# EAGLE design Skaarhoj VU board (EAGLE 6.2)
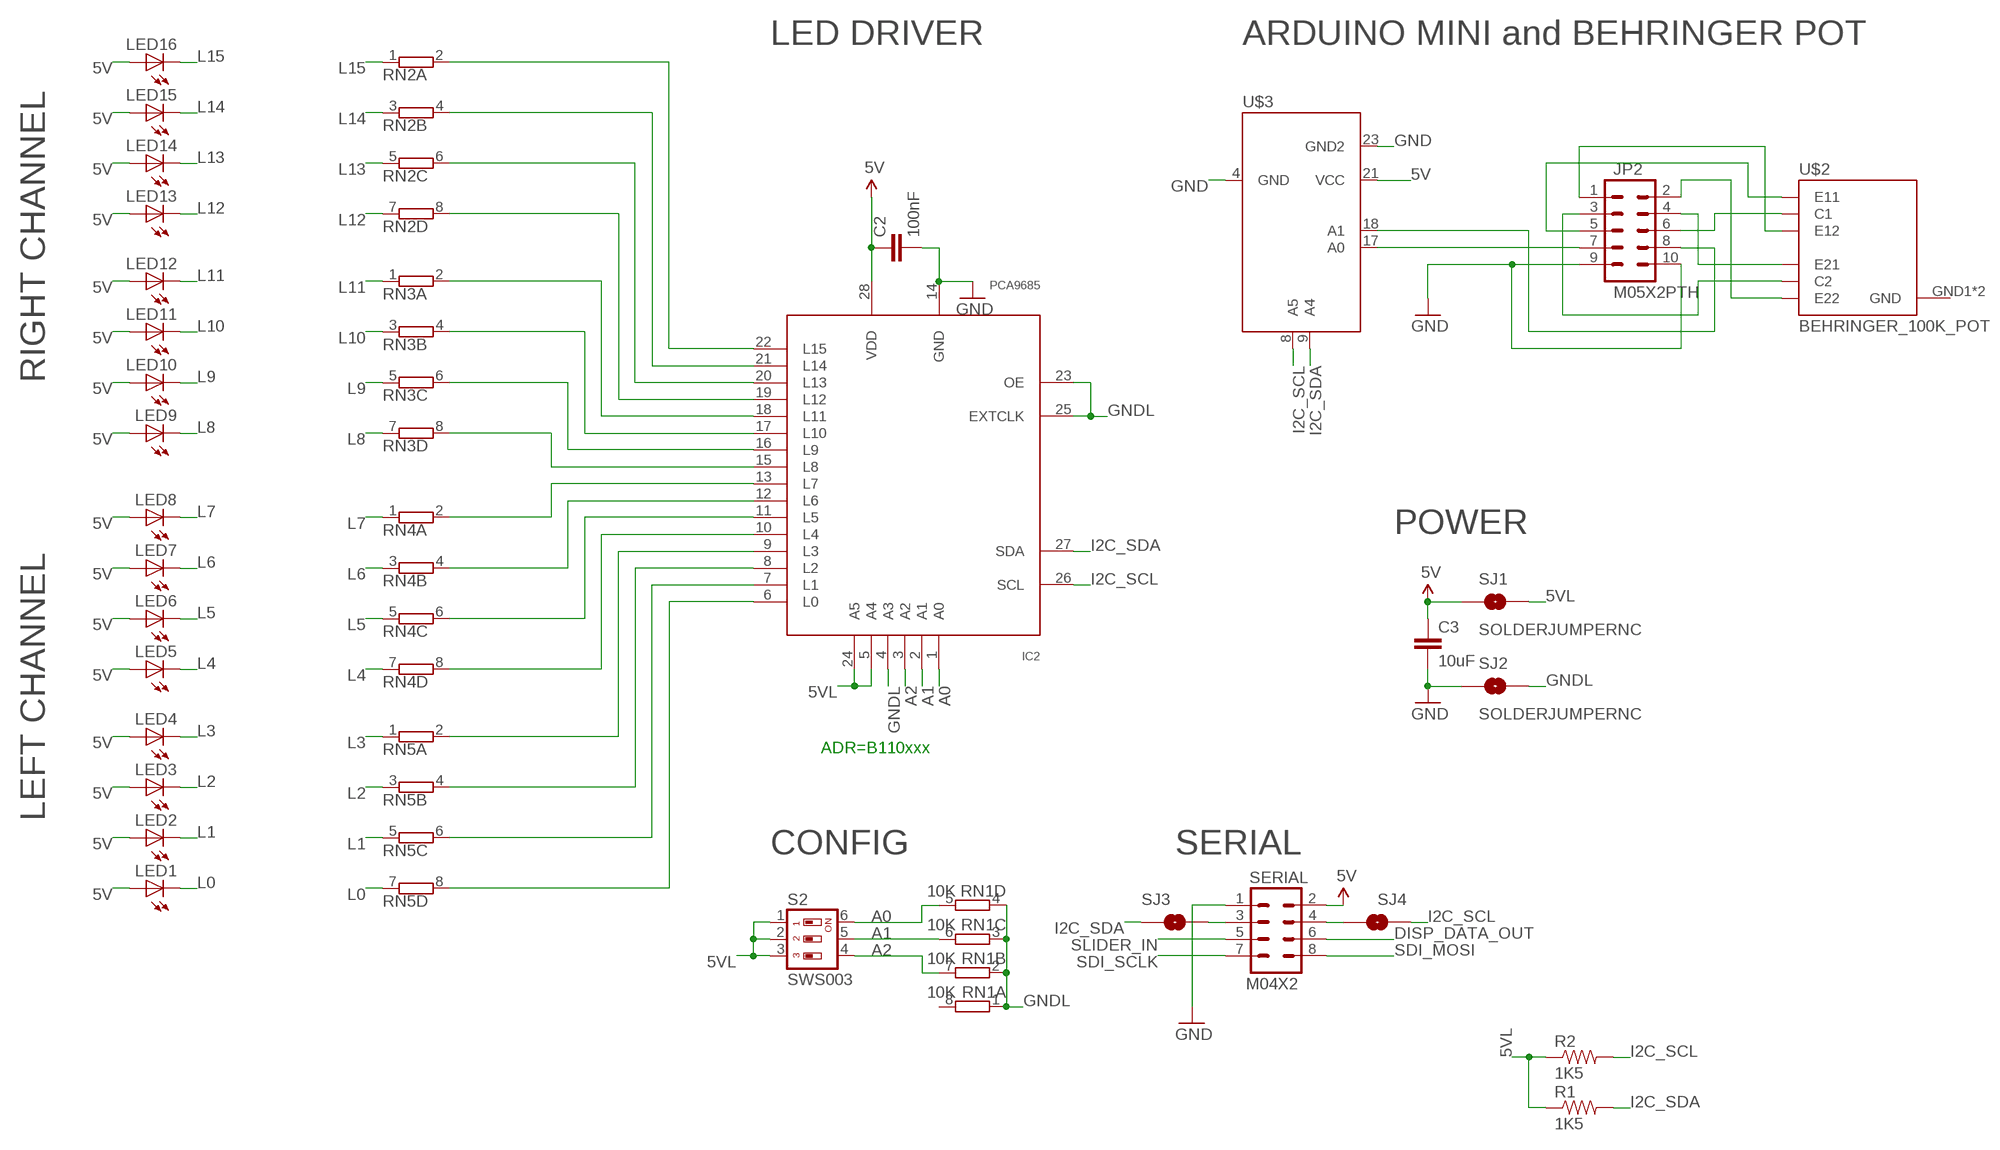
[diagram p0: schematic, sheet 1]

## Parts
C2  100nF  CAP0603-CAP  [0603-CAP]
C3  10uF  CAP0805  [0805]
IC2  PCA9685  [TSSOP28]
JP2  M05X2PTH  [AVR_ICSP]
LED1  LED3MM  [LED3MM]
LED2  LED3MM  [LED3MM]
LED3  LED3MM  [LED3MM]
LED4  LED3MM  [LED3MM]
LED5  LED3MM  [LED3MM]
LED6  LED3MM  [LED3MM]
LED7  LED3MM  [LED3MM]
LED8  LED3MM  [LED3MM]
LED9  LED3MM  [LED3MM]
LED10  LED3MM  [LED3MM]
LED11  LED3MM  [LED3MM]
LED12  LED3MM  [LED3MM]
LED13  LED3MM  [LED3MM]
LED14  LED3MM  [LED3MM]
LED15  LED3MM  [LED3MM]
LED16  LED3MM  [LED3MM]
R1  1K5  RESISTOR0603-RES  [0603-RES]
R2  1K5  RESISTOR0603-RES  [0603-RES]
RN1  10K  4R-NCAY16  [CAY16_HAND]
RN2  E4R  [SIL8]
RN3  E4R  [SIL8]
RN4  E4R  [SIL8]
RN5  E4R  [SIL8]
S2  SWS003  [SMS-003]
SERIAL  M04X2  [2X4]
SJ1  SOLDERJUMPERNC  [SJ_2S]
SJ2  SOLDERJUMPERNC  [SJ_2S]
SJ3  SOLDERJUMPERNC  [SJ_2S]
SJ4  SOLDERJUMPERNC  [SJ_2S]
U$2  BEHRINGER_100K_POT  [BEHRINGER_100K_POT]
U$3  ARDUINO_MINI_SE1  [ARDUINO_MINI_SE1]

## Nets
5V [Power]: C2.1 C3.1 IC2.28(VDD) LED1.A LED2.A LED3.A LED4.A LED5.A LED6.A LED7.A LED8.A LED9.A LED10.A LED11.A LED12.A LED13.A LED14.A LED15.A LED16.A SERIAL.2 SJ1.1 U$3.21(VCC)
5VL: IC2.5(A4) IC2.24(A5) R1.1 R2.1 S2.1 S2.2 S2.3 SJ1.2
A0: IC2.1(A0) RN1.5 S2.6
A1: IC2.2(A1) RN1.6 S2.5
A2: IC2.3(A2) RN1.7 S2.4
DISP_DATA_OUT: SERIAL.6
GND [Power]: C2.2 C3.2 IC2.14(GND) JP2.9 JP2.10 SERIAL.1 SJ2.1 U$3.4(GND) U$3.23(GND2)
GNDL: IC2.4(A3) IC2.23(OE) IC2.25(EXTCLK) RN1.1 RN1.2 RN1.3 RN1.4 SJ2.2
I2C_SCL: IC2.26(SCL) R2.2 SJ4.2 U$3.8(A5)
I2C_SDA: IC2.27(SDA) R1.2 SJ3.1 U$3.9(A4)
L0: LED1.K(C) RN5.7
L1: LED2.K(C) RN5.5
L2: LED3.K(C) RN5.3
L3: LED4.K(C) RN5.1
L4: LED5.K(C) RN4.7
L5: LED6.K(C) RN4.5
L6: LED7.K(C) RN4.3
L7: LED8.K(C) RN4.1
L8: LED9.K(C) RN3.7
L9: LED10.K(C) RN3.5
L10: LED11.K(C) RN3.3
L11: LED12.K(C) RN3.1
L12: LED13.K(C) RN2.7
L13: LED14.K(C) RN2.5
L14: LED15.K(C) RN2.3
L15: LED16.K(C) RN2.1
N$1: JP2.6 U$2.PAD1(C1)
N$2: JP2.4 U$2.PAD3(E21)
N$3: SERIAL.3 SJ3.2
N$4: IC2.13(L7) RN4.2
N$5: IC2.12(L6) RN4.4
N$6: SERIAL.4 SJ4.1
N$7: IC2.11(L5) RN4.6
N$8: JP2.3 U$2.PAD4(C2)
N$9: IC2.10(L4) RN4.8
N$10: IC2.9(L3) RN5.2
N$11: IC2.8(L2) RN5.4
N$12: IC2.7(L1) RN5.6
N$13: JP2.2 U$2.PAD5(E22)
N$14: JP2.5 U$2.PAD2(E11)
N$15: JP2.1 U$2.PAD6(E12)
N$16: JP2.8 U$3.18(A1)
N$17: JP2.7 U$3.17(A0)
N$19: IC2.6(L0) RN5.8
N$20: IC2.15(L8) RN3.8
N$21: IC2.16(L9) RN3.6
N$22: IC2.17(L10) RN3.4
N$23: IC2.18(L11) RN3.2
N$24: IC2.19(L12) RN2.8
N$25: IC2.20(L13) RN2.6
N$26: IC2.21(L14) RN2.4
N$27: IC2.22(L15) RN2.2
SDI_MOSI: SERIAL.8
SDI_SCLK: SERIAL.7
SLIDER_IN: SERIAL.5
Unconnected: RN1.8

## Notes on the sheet
- LED DRIVER | ARDUINO MINI and BEHRINGER POT
- RIGHT CHANNEL
- POWER
- ADR=B110xxx
- LEFT CHANNEL
- CONFIG | SERIAL

## Power pins joined to a net without a drawn wire
GND: U$2.GND1(GND) U$2.GND2(GND)

## Library data of the parts
C2 C3 = SparkFun:CAP: Capacitor Standard 0603 ceramic capacitor, and 0.1" leaded capacitor.
IC2 = wsmith:PCA9685
JP2 = SparkFun:M05X2: Header 5x2 Standard 10-pin dual row 0.1" header. Commonly used with AVR-ISP. Use with Spark Fun Electronics SKU: PRT-00778
LED1-LED16 = SparkFun:LED: LEDs Standard schematic elements and footprints for 5mm, 3mm, 1206, and 0603 sized LEDs. 5mm - Spark Fun Electronics SKU : COM-00529 (and others)
R1 R2 = SparkFun:RESISTOR: Resistor Basic schematic elements and footprints for 0603, 1206, and PTH resistors.
RN1 = SKAARHOJ:4R-N: Array Chip Resistor Source: RS Component / Phycomp; OC_FARNELL: unknown; OC_NEWARK: unknown
RN2-RN5 = SKAARHOJ:E4R: SIL RESISTOR; OC_FARNELL: unknown; OC_NEWARK: unknown
S2 = smd-special:SWS003: SMD Dip Switch 3 pol.
SERIAL = SparkFun:M04X2
SJ1-SJ4 = SparkFun:SOLDERJUMPER: Solder Jumper Standard SMD solder jumper. Used to automate production. Two varients : Normally Open and Normally Closed are the same, but have different paste layers. NC will have a large amount of paste and should jumper during reflow.
U$2 = SKAARHOJ:BEHRINGER_100K_POT
U$3 = SKAARHOJ:ARDUINO_MINI_SE1

## Net classes
0 default: width 0.203 mm, drill 0.406 mm, clearance 0.203 mm
1 Power: width 0.406 mm, drill 0.61 mm, clearance 0.203 mm

## Board
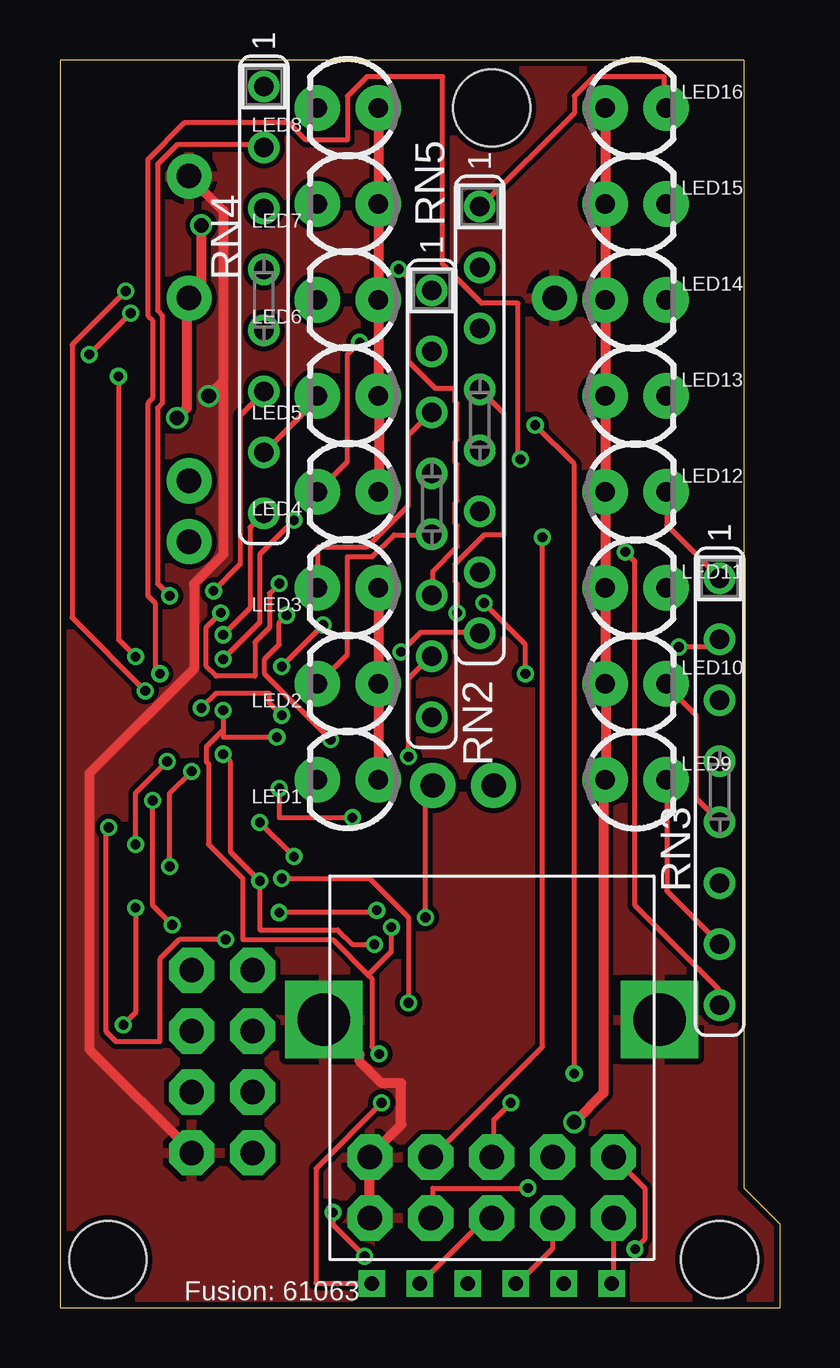
[diagram p1: board, top side]
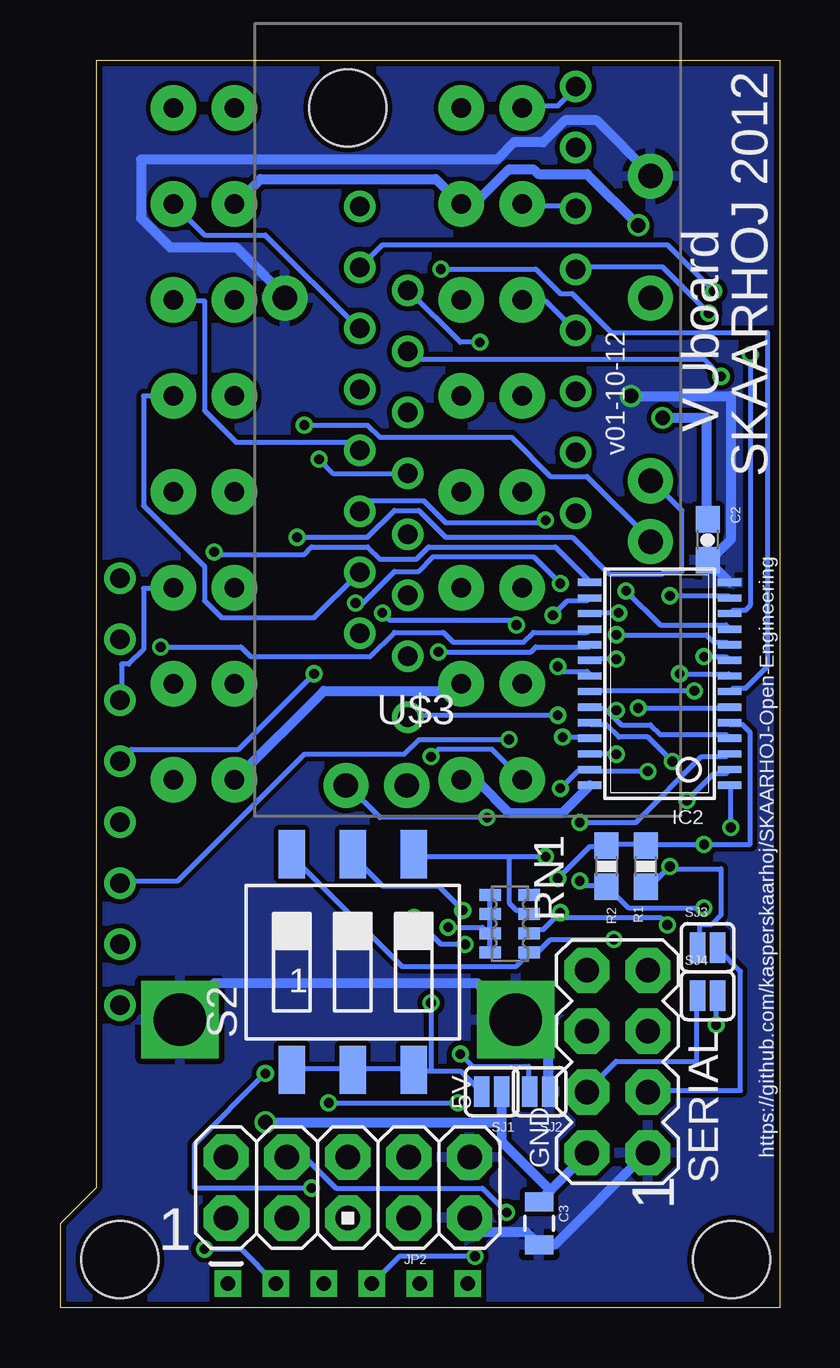
[diagram p2: board, bottom side, seen from below]

Size 30 x 52 mm. Coordinates in mm from the lower left corner, seen from the top.
Outline: 0,0 30,0 30,3.5 28.5,5 28.5,52 0,52 0,0
Copper layers (1*16): Top 0.035mm / dielectric 1.5mm / Bottom 0.035mm
Design rules: minimum track width 6mil, minimum drill 12mil, track to track 6mil, track to pad 6mil, pad to pad 6mil, via to via 6mil, smd to smd 0mil, copper to edge 10mil, drill to drill 10mil, minimum pad ring 10mil, minimum via ring 6mil, stop-mask expansion 2mil, vias tented up to drill 100mil, thermal gap 10mil
Holes 3.2 mm at 2,2 27.5,2 18,50

### Footprints (pad centres in the part's own frame; a part is rotated, then mirrored left to right if it is on the bottom)
0603-CAP = smd 1.1 x 1: 1 -0.85,0; 2 0.85,0
0805 = smd 0.8 x 1.2: 1 -0.9,0; 2 0.9,0
TSSOP28 = smd 0.305 x 0.991: 1 -4.225,-2.918; 2 -3.575,-2.918; 3 -2.925,-2.918; 4 -2.275,-2.918; 5 -1.625,-2.918; 6 -0.975,-2.918; 7 -0.325,-2.918; 8 0.325,-2.918; 9 0.975,-2.918; 10 1.625,-2.918; 11 2.275,-2.918; 12 2.925,-2.918; 13 3.575,-2.918; 14 4.225,-2.918; 15 4.225,2.918; 16 3.575,2.918; 17 2.925,2.918; 18 2.275,2.918; 19 1.625,2.918; 20 0.975,2.918; 21 0.325,2.918; 22 -0.325,2.918; 23 -0.975,2.918; 24 -1.625,2.918; 25 -2.275,2.918; 26 -2.925,2.918; 27 -3.575,2.918; 28 -4.225,2.918
AVR_ICSP = drill 1.016 pad 1.88 octagon: 1 -1.27,5.08; 2 1.27,5.08; 3 -1.27,2.54; 4 1.27,2.54; 5 -1.27,0; 6 1.27,0; 7 -1.27,-2.54; 8 1.27,-2.54; 9 -1.27,-5.08; 10 1.27,-5.08
LED3MM = drill 0.813 pad 1.88: A -1.27,0; K 1.27,0
0603-RES = smd 1.1 x 1: 1 -0.85,0; 2 0.85,0
CAY16_HAND = smd 0.5 x 0.904: 1 -1.2,-0.813; 2 -0.4,-0.813; 3 0.4,-0.813; 4 1.2,-0.813; 5 1.2,0.813; 6 0.4,0.813; 7 -0.4,0.813; 8 -1.2,0.813
SIL8 = drill 0.813: 1 -8.89,0; 2 -6.35,0; 3 -3.81,0; 4 -1.27,0; 5 1.27,0; 6 3.81,0; 7 6.35,0; 8 8.89,0
SMS-003 = smd 1.092 x 2.007: 1 -2.54,-4.496; 2 0,-4.496; 3 2.54,-4.496; 4 2.54,4.496; 5 0,4.496; 6 -2.54,4.496
2X4 = drill 1.016 pad 1.88 octagon: 1 -3.81,-1.27; 2 -3.81,1.27; 3 -1.27,-1.27; 4 -1.27,1.27; 5 1.27,-1.27; 6 1.27,1.27; 7 3.81,-1.27; 8 3.81,1.27
SJ_2S = smd 0.635 x 1.27: 1 -0.412,0; 2 0.412,0
BEHRINGER_100K_POT = drill 2.2 square: GND1 -7,0; GND2 7,0 | drill 0.6 square: PAD1 -5,-11; PAD2 -3,-11; PAD3 -1,-11; PAD4 1,-11; PAD5 3,-11; PAD6 5,-11
ARDUINO_MINI_SE1 = drill 1.016 pad 1.88: 4 -7.62,5.08; 8 -2.54,-15.24; 9 -5.08,-15.24; 17 7.62,-5.08; 18 7.62,-2.54; 21 7.62,5.08; 23 7.62,10.16

### Placement (x,y rotation side)
C2  3,32 270 bottom
C3  10.02,3.51 270 bottom
IC2  5,26 90 bottom
JP2  18,5 90 bottom
LED1  12,22 180 top
LED2  12,26 180 top
LED3  12,30 180 top
LED4  12,34 180 top
LED5  12,38 180 top
LED6  12,42 180 top
LED7  12,46 180 top
LED8  12,50 180 top
LED9  24,22 0 top
LED10  24,26 0 top
LED11  24,30 0 top
LED12  24,34 0 top
LED13  24,38 0 top
LED14  24,42 0 top
LED15  24,46 0 top
LED16  24,50 0 top
R1  5.58,18.4 270 bottom
R2  7.21,18.4 270 bottom
RN1  11.25,16 270 bottom
RN2  17.5,37 270 top
RN3  27.5,21.5 270 top
RN4  8.5,42 270 top
RN5  15.5,33.5 270 top
S2  17.79,14.4 0 bottom
SERIAL  6.76,10.25 90 bottom
SJ1  12,9 180 bottom
SJ2  10,9 180 bottom
SJ3  3,15 0 bottom
SJ4  3,13 0 bottom
U$2  18,12 0 top
U$3  13,37 0 bottom

### Tracks (layer width: path | path; a pad name or v marks a point on that pad's centre or on a via)
5V  (via drill 0.61)
  Top 0.406: v4.88,37.08 5.28,37.49 5.28,42.06 U$3.21 5.38,42.27 5.89,42.77 v5.89,45.11 | LED4.A 13.31,34.04 13.31,38 LED5.A 13.31,38.2 13.31,41.96 LED6.A 13.31,42.16 13.31,45.92 LED7.A 13.31,46.13 13.31,49.99 LED8.A | LED1.A 13.31,22.05 13.31,25.91 LED2.A 13.31,26.11 13.31,29.97 LED3.A | LED16.A 22.76,49.99 22.76,46.13 LED15.A 22.76,45.92 22.76,42.16 LED14.A 22.76,41.96 22.76,38.2 LED13.A 22.76,38 22.76,34.14 LED12.A 22.76,33.93 22.76,30.18 LED11.A 22.76,29.97 22.76,26.21 LED10.A 22.76,25.91 22.76,22.05 LED9.A 22.66,21.84 22.66,8.94 v21.44,7.72
  Bottom 0.406: v4.88,37.08 3.05,37.08 3.05,32.92 C2.1 | v5.89,45.11 8.03,47.24 10.06,47.24 10.26,47.45 11.28,47.45 12.7,46.02 13.21,46.02 LED7.A 13.41,46.13 14.33,47.04 21.64,47.04 22.66,46.02 LED15.A | IC2.28 7.92,21.74 9.04,20.62 11.28,20.62 12.6,21.95 13.21,21.95 LED1.A | 9.55,4.88 8.03,6.4 SERIAL.2 | 9.55,4.88 9.96,4.47 C3.1 | 11.58,7.72 11.58,6.91 9.55,4.88 | 11.58,7.72 11.58,8.94 SJ1.1 | v21.44,7.72 11.58,7.72 | LED2.A 13.31,25.91 13.51,25.7 19,25.7 22.66,22.05 LED9.A
5VL  (via drill 0.41)
  Top 0.203: v4.47,22.76 3.15,21.44 v3.15,19.3 | v14.53,12.7 14.53,16.26 12.9,17.88 v9.25,17.88
  Bottom 0.203: 14.53,9.86 15.24,9.86 S2.3 15.34,9.96 17.78,9.96 S2.2 17.88,9.96 20.32,9.96 S2.1 | 14.53,9.86 13.31,9.86 12.5,9.04 SJ1.2 | IC2.5 2.03,24.28 1.52,24.28 1.22,23.98 1.22,19.3 v3.15,19.3 5.49,19.3 R1.1 5.59,19.3 7.11,19.3 R2.1 7.21,19.2 7.92,19.2 v9.25,17.88 | v4.47,22.76 5.49,23.77 6.71,23.77 7.21,24.28 7.82,24.28 IC2.24 | v14.53,12.7 14.53,9.86
A0  (via drill 0.41)
  Top 0.203: v2.03,20.02 1.93,19.91 1.93,11.48 2.34,11.07 4.17,11.07 4.17,14.53 4.98,15.34 v6.91,15.34
  Bottom 0.203: S2.6 20.32,18.8 15.75,14.22 10.97,14.22 10.46,14.73 RN1.5 10.36,14.83 10.06,14.83 9.55,15.34 v6.91,15.34 | v2.03,20.02 2.03,21.74 IC2.1
A1  (via drill 0.41)
  Top 0.203: v9.14,16.46 13.21,16.46 v13.21,16.56 | v3.86,21.13 3.86,16.76 v4.67,15.95
  Bottom 0.203: v13.21,16.56 14.22,17.58 16.56,17.58 17.78,18.8 S2.5 | RN1.6 10.36,15.65 10.26,15.75 9.86,15.75 v9.14,16.46 9.25,16.26 4.98,16.26 v4.67,15.95 | v3.86,21.13 2.74,22.25 2.23,22.25 2.13,22.35 IC2.2
A2  (via drill 0.41)
  Top 0.203: v9.75,18.8 v8.33,20.22
  Bottom 0.203: 11.28,18.8 11.28,16.87 10.97,16.56 10.57,16.56 10.46,16.46 RN1.7 | 11.28,18.8 15.24,18.8 S2.4 | v8.33,20.22 5.99,20.22 3.25,22.96 2.23,22.96 2.13,23.06 IC2.3 | 11.28,18.8 v9.75,18.8
GND  (via drill 0.61)
  Top 0.406: JP2.9 12.9,3.76 12.9,6.2 JP2.10 13.01,6.4 14.22,7.62 14.22,9.35 13.41,9.35 12.5,10.26 12.5,10.57 11.07,11.99 U$2.GND1 | 6.71,38.51 6.81,38.61 6.81,45.72 5.38,47.14 U$3.23 | 6.71,38.51 v6.2,38 | SERIAL.1 5.49,6.5 1.22,10.77 1.22,22.25 5.59,26.62 5.59,30.18 6.81,31.39 6.81,38.41 6.71,38.51
  Bottom 0.406: SJ2.1 9.65,9.04 9.65,11.99 10.97,11.99 U$2.GND1 11.18,12.09 12.6,13.51 23.57,13.51 24.99,12.09 U$2.GND2 | JP2.9 12.9,3.66 12.39,3.15 10.57,3.15 10.06,2.64 C3.2 9.86,2.64 9.35,2.64 5.59,6.4 SERIAL.1 | IC2.14 2.13,30.28 2.95,31.09 C2.2 2.85,31.19 2.03,32 2.03,38 v6.2,38 | U$3.4 20.62,42.16 22.66,44.2 25.4,44.2 26.62,45.41 26.62,47.85 11.79,47.85 11.07,48.56 9.86,48.56 8.94,49.48 7.62,49.48 5.38,47.24 U$3.23
  pour Top: 0,0 0,52 30,52 30,0
  pour Bottom: 0,0 0,52 30,52 30,0
GNDL  (via drill 0.41)
  Top 0.203: v9.04,23.77 6.81,23.77 6.81,24.08 | v6.81,24.89 6.81,24.08 | v13.31,10.57 13.01,10.87 13.01,13.72 12.85,13.87 | 12.85,13.87 11.38,15.34 7.62,15.34 7.62,17.88 6.2,19.3 6.2,22.66 6.1,22.76 6.1,23.37 6.81,24.08 | v13.82,15.85 13.82,14.83 12.85,13.87
  Bottom 0.203: RN1.4 12.09,14.83 12.09,15.54 RN1.3 | RN1.1 12.09,17.17 12.09,16.46 RN1.2 12.09,16.36 12.09,15.65 RN1.3 | 7.06,24.74 7.32,24.99 7.82,24.99 IC2.23 | 7.06,24.74 6.6,24.28 5.38,24.28 4.98,23.88 2.23,23.88 2.13,23.77 IC2.4 | v9.04,23.77 7.92,23.77 IC2.25 | v6.81,24.89 6.91,24.79 7.01,24.79 7.06,24.74 | v13.31,10.57 12.8,10.06 10.46,10.06 10.46,9.04 SJ2.2 | v13.82,15.85 12.39,15.85 12.19,15.65 RN1.3
I2C_SCL  (via drill 0.41)
  Top 0.203: v6.81,23.06 7.11,22.76 7.11,19 v8.33,17.78 8.33,15.75 11.58,15.75 12.19,15.14 v13.11,15.14 | v2.64,11.79 3.15,12.29 v3.15,16.66 | v15.24,16.26 15.24,21.54 15.44,21.74 U$3.8
  Bottom 0.203: v6.81,23.06 7.82,23.06 IC2.26 | v8.33,17.78 8.13,17.58 7.21,17.58 R2.2 7.11,17.48 6.3,16.66 v3.15,16.66 | v2.64,11.79 2.64,12.9 SJ4.2 | v15.24,16.26 14.12,15.14 v13.11,15.14
I2C_SDA  (via drill 0.41)
  Top 0.203: v5.49,22.35 4.57,21.44 v4.57,18.39 | v12.19,20.42 9.14,20.42 v9.14,21.64
  Bottom 0.203: v5.49,22.35 7.82,22.35 IC2.27 7.92,22.35 8.43,22.35 v9.14,21.64 | R1.2 5.49,17.58 5.38,17.58 v4.57,18.39 4.57,18.29 2.44,18.29 2.44,16.36 2.85,15.95 3.35,15.95 3.35,15.04 SJ3.1 | v12.19,20.42 16.66,20.42 17.98,21.74 U$3.9
L0  (via drill 0.41)
  Top 0.203: v14.53,22.96 14.53,26.21 15.44,27.13 RN5.7
  Bottom 0.203: v14.53,22.96 14.22,23.27 11.99,23.27 10.77,22.05 LED1.K
L1
  Top 0.203: RN5.5 15.44,32.21 13.92,32.21 13.01,31.29 11.99,31.29 11.99,27.23 10.77,26.01 LED2.K
L2
  Top 0.203: RN5.3 15.44,37.29 14.53,36.37 14.53,33.43 12.8,31.7 10.77,31.7 10.77,30.07 LED3.K
L3  (via drill 0.41)
  Top 0.203: v12.5,40.23 11.99,39.73 11.99,35.26 10.77,34.04 LED4.K
  Bottom 0.203: v12.5,40.23 13.31,40.23 15.44,42.37 RN5.1
L4
  Top 0.203: RN4.7 8.53,35.66 10.67,37.8 10.67,38 LED5.K
L5
  Bottom 0.203: RN4.5 8.53,40.74 9.75,41.96 10.67,41.96 LED6.K
L6
  Bottom 0.203: RN4.3 8.53,45.82 8.64,45.92 10.67,45.92 LED7.K
L7
  Bottom 0.203: RN4.1 8.53,50.8 9.25,50.09 10.67,50.09 LED8.K
L8
  Top 0.203: RN3.7 27.43,15.24 25.3,17.37 25.3,21.95 LED9.K
L9
  Top 0.203: RN3.5 27.43,20.32 26.52,21.23 26.52,24.69 25.3,25.91 LED10.K
L10
  Bottom 0.203: RN3.3 27.43,25.4 27.43,26.82 27.13,26.82 26.52,27.43 26.52,29.97 25.3,29.97 LED11.K
L11
  Top 0.203: RN3.1 27.43,30.48 25.3,32.61 25.3,33.93 LED12.K
L12
  Bottom 0.203: RN2.7 17.58,30.58 19.41,28.75 23.27,28.75 23.98,29.46 23.98,30.89 26.52,33.43 26.52,38 25.3,38 LED13.K
L13
  Bottom 0.203: RN2.5 17.58,35.76 17.88,36.07 22.66,36.07 23.98,37.39 23.98,41.96 25.2,41.96 LED14.K
L14
  Bottom 0.203: RN2.3 17.58,40.84 21.44,44.7 23.98,44.7 25.2,45.92 LED15.K
L15
  Top 0.203: RN2.1 17.58,45.92 21.44,49.78 21.44,50.49 22.25,51.31 25.2,51.31 25.2,50.09 LED16.K
N$1  (via drill 0.41)
  Top 0.203: v13.41,8.53 10.67,5.79 10.67,1.02 12.9,1.02 U$2.PAD1 | v18.8,8.53 18.09,7.82 18.09,6.3 JP2.6
  Bottom 0.203: v18.8,8.53 v13.41,8.53
N$2  (via drill 0.41)
  Top 0.203: v12.7,2.13 11.38,3.45 v11.38,3.96
  Bottom 0.203: v12.7,2.13 15.85,2.13 16.97,1.02 U$2.PAD3 | v11.38,3.96 12.39,4.98 18.49,4.98 19.71,6.2 20.52,6.2 JP2.4
N$3
  Bottom 0.203: SJ3.2 2.54,14.94 1.63,14.02 1.63,9.04 5.49,9.04 SERIAL.3
N$4  (via drill 0.41)
  Top 0.203: v4.57,29.67 4.06,30.18 4.06,37.49 4.27,37.69 4.27,41.35 4.06,41.55 4.06,47.65 4.88,48.46 8.43,48.46 8.43,48.36 RN4.2
  Bottom 0.203: v4.57,29.67 2.13,29.67 IC2.13
N$5  (via drill 0.41)
  Top 0.203: v2.95,41.45 v1.22,39.73
  Bottom 0.203: v1.22,39.73 1.22,29.26 1.42,29.06 1.93,29.06 2.03,28.96 IC2.12 | v2.95,41.45 4.88,43.38 8.33,43.38 8.43,43.28 RN4.4
N$6
  Bottom 0.203: SJ4.1 3.45,12.9 3.45,10.26 6.81,10.26 8.03,9.04 SERIAL.4
N$7  (via drill 0.41)
  Top 0.203: v6.4,29.87 7.52,30.99 7.52,37.19 8.43,38.1 RN4.6
  Bottom 0.203: v6.4,29.87 4.98,28.45 2.23,28.45 2.13,28.35 IC2.11
N$8
  Top 0.203: U$2.PAD4 19.1,1.02 20.52,2.44 20.52,3.66 JP2.3
N$9  (via drill 0.41)
  Top 0.203: v6.81,28.04 7.92,29.16 7.92,32.51 8.43,33.02 RN4.8
  Bottom 0.203: v6.81,28.04 3.05,28.04 2.74,27.74 2.23,27.74 2.13,27.64 IC2.10
N$10  (via drill 0.41)
  Top 0.203: v3.15,27.13 2.44,27.84 v2.44,38.81
  Bottom 0.203: v3.15,27.13 2.23,27.13 2.13,27.03 IC2.9 | v2.44,38.81 3.15,39.52 15.14,39.52 15.44,39.83 RN5.2
N$11  (via drill 0.41)
  Top 0.203: v4.17,26.42 3.96,26.62 3.96,29.36 3.66,29.67 3.66,37.69 3.86,37.9 3.86,41.15 3.66,41.35 3.66,47.85 5.18,49.38 9.55,49.38 10.26,48.67 11.99,48.67 11.99,50.49 12.8,51.31 15.95,51.31 15.95,43.48 17.58,41.86 19.1,41.86 19.1,35.46 v19.2,35.36
  Bottom 0.203: v4.17,26.42 2.13,26.42 IC2.8 | v19.2,35.36 18.59,34.75 15.54,34.75 RN5.4
N$12  (via drill 0.41)
  Top 0.203: v14.12,43.28 14.53,42.88 14.53,39.42 15.65,38.3 16.46,38.3 16.46,37.8 16.56,37.69 16.56,36.17 16.46,36.07 16.46,35.26 16.56,35.15 16.56,33.63 16.46,33.53 16.46,32.72 16.56,32.61 16.56,31.7 15.54,30.68 15.54,29.77 RN5.6
  Bottom 0.203: v14.12,43.28 10.16,43.28 9.14,42.27 8.64,42.27 7.01,40.64 0.51,40.64 0.51,26.72 1.42,25.81 1.93,25.81 2.03,25.7 IC2.7
N$13  (via drill 0.41)
  Top 0.203: v23.98,2.44 24.38,2.85 24.38,4.98 23.16,6.2 JP2.2
  Bottom 0.203: v23.98,2.44 22.45,2.44 21.03,1.02 U$2.PAD5
N$14
  Top 0.203: U$2.PAD2 15.04,1.02 17.68,3.66 17.98,3.66 JP2.5
N$15
  Top 0.203: U$2.PAD6 23.06,1.02 23.06,3.66 JP2.1
N$16  (via drill 0.41)
  Top 0.203: v20.12,32.11 20.12,10.87 15.54,6.3 JP2.8
  Bottom 0.203: v20.12,32.11 17.17,32.11 16.05,33.22 15.04,33.22 13.92,32.11 8.64,32.11 7.11,30.58 4.88,30.58 4.78,30.68 4.06,30.68 4.06,33.22 5.28,34.44 U$3.18
N$17  (via drill 0.41)
  Top 0.203: v19.81,36.78 21.44,35.15 v21.44,9.75 | v19.51,4.98 15.54,4.98 15.54,3.76 JP2.7
  Bottom 0.203: v19.81,36.78 17.17,36.78 16.66,36.27 11.18,36.27 9.55,34.65 8.03,34.65 5.38,32 U$3.17 | v21.44,9.75 24.38,6.81 24.38,4.98 v19.51,4.98
N$19  (via drill 0.41)
  Top 0.203: v5.89,24.99 6.5,25.6 8.74,25.6 8.74,25.2 v9.25,24.69
  Bottom 0.203: v5.89,24.99 2.13,24.99 IC2.6 | v9.25,24.69 15.44,24.69 RN5.8
N$20  (via drill 0.41)
  Top 0.203: v23.57,31.5 23.98,31.09 23.98,16.76 27.43,13.31 27.43,12.7 RN3.8
  Bottom 0.203: v23.57,31.5 23.47,31.39 19.81,31.39 19.51,31.7 17.17,31.7 16.66,31.19 15.14,31.19 14.63,31.7 9.35,31.7 7.92,30.28 IC2.15
N$21  (via drill 0.41)
  Top 0.203: v9.45,28.85 9.14,28.55 9.14,27.64 8.53,27.03 8.53,26.42 v11.28,23.67
  Bottom 0.203: v9.45,28.85 8.84,29.46 8.03,29.46 IC2.16 | v11.28,23.67 15.04,23.67 15.65,23.06 19.81,23.06 25.09,17.78 27.43,17.78 RN3.6
N$22  (via drill 0.41)
  Top 0.203: v6.71,28.96 6.1,28.35 6.1,26.72 6.5,26.31 8.13,26.31 8.13,27.74 8.74,28.35 8.74,29.77 v9.14,30.18 | v17.68,29.36 19.41,27.64 v19.41,26.42
  Bottom 0.203: v6.71,28.96 7.82,28.96 IC2.17 | v9.14,30.18 10.26,31.29 14.43,31.29 15.04,30.68 16.05,30.68 17.37,29.36 v17.68,29.36 | v19.41,26.42 22.55,23.27 27.03,23.27 27.43,22.86 RN3.4
N$23  (via drill 0.41)
  Top 0.203: v25.81,27.53 27.43,27.53 27.43,27.84 RN3.2
  Bottom 0.203: v25.81,27.53 22.45,27.53 22.05,27.13 17.07,27.13 16.05,28.14 14.02,28.14 13.61,27.74 10.67,27.74 10.26,28.14 8.03,28.14 7.92,28.25 IC2.18
N$24  (via drill 0.41)
  Top 0.203: v14.22,27.33 15.04,28.14 17.48,28.14 RN2.8
  Bottom 0.203: v14.22,27.33 10.36,27.33 10.16,27.53 7.92,27.53 IC2.19
N$25  (via drill 0.41)
  Top 0.203: v6.81,27.03 8.33,28.55 8.33,31.39 v9.75,32.82
  Bottom 0.203: v6.81,27.03 7.82,27.03 IC2.20 | v9.75,32.82 9.86,32.72 13.92,32.72 14.83,33.63 17.07,33.63 17.48,33.22 RN2.6
N$26  (via drill 0.41)
  Top 0.203: v10.97,28.45 v9.25,26.72 | v16.56,28.96 16.56,30.18 16.46,30.28 16.46,30.99 17.68,32.21 18.49,32.21 18.49,37.29 17.58,38.2 RN2.4
  Bottom 0.203: v9.25,26.72 9.04,26.52 8.03,26.52 7.92,26.42 IC2.21 | v10.97,28.45 11.18,28.65 16.26,28.65 v16.56,28.96
N$27  (via drill 0.41)
  Top 0.203: v3.56,25.7 0.51,28.75 0.51,40.13 v2.74,42.37
  Bottom 0.203: v3.56,25.7 7.82,25.7 IC2.22 | v2.74,42.37 4.67,44.3 16.56,44.3 17.48,43.38 RN2.2

### Text on the board
_tsilk: Fusion: 61063
_bsilk: SKAARHOJ 2012 | VUboard | v01-10-12 | https://github.com/kasperskaarhoj/SKAARHOJ-Open-Engineering | 5V | GND | 1 | 1